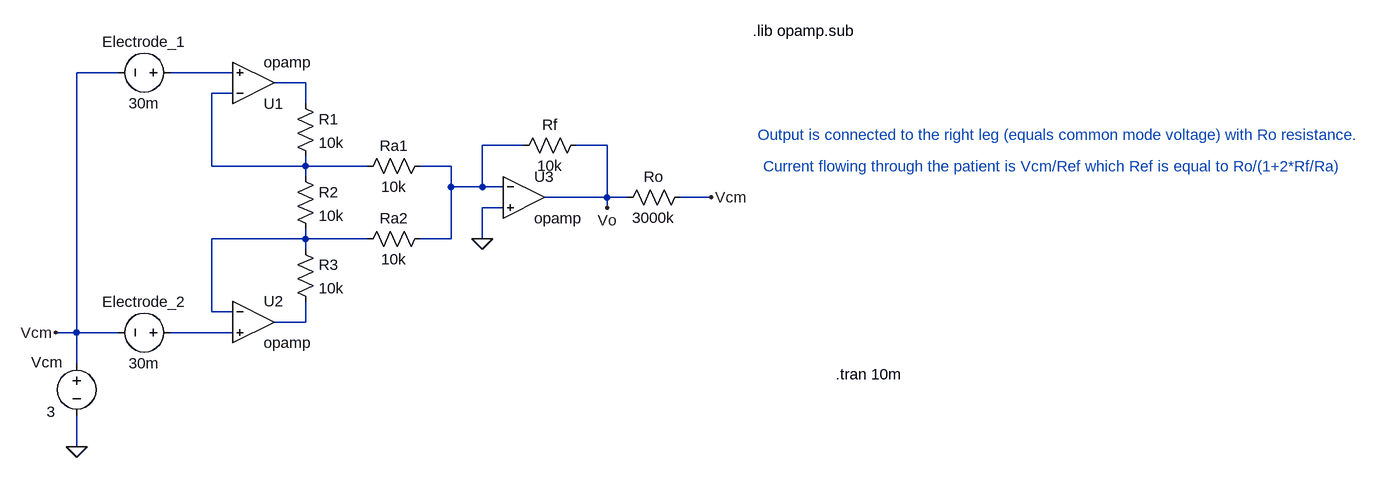
[diagram p0: schematic RightLegDriver.asc]
RightLegDriver.asc, the LTspice schematic file:
Version 4
SHEET 1 1248 932
WIRE -752 -64 -816 -64
WIRE -576 -64 -672 -64
WIRE -464 -48 -512 -48
WIRE -576 -32 -608 -32
WIRE -464 -16 -464 -48
WIRE -128 48 -192 48
WIRE 0 48 -48 48
WIRE -608 80 -608 -32
WIRE -464 80 -464 64
WIRE -464 80 -608 80
WIRE -368 80 -464 80
WIRE -240 80 -288 80
WIRE -464 96 -464 80
WIRE -240 112 -240 80
WIRE -192 112 -192 48
WIRE -192 112 -240 112
WIRE -160 112 -192 112
WIRE 0 128 0 48
WIRE 0 128 -96 128
WIRE 32 128 0 128
WIRE 160 128 112 128
WIRE -160 144 -192 144
WIRE 0 144 0 128
WIRE -464 192 -464 176
WIRE -464 192 -608 192
WIRE -368 192 -464 192
WIRE -240 192 -240 112
WIRE -240 192 -288 192
WIRE -192 192 -192 144
WIRE -464 208 -464 192
WIRE -608 304 -608 192
WIRE -576 304 -608 304
WIRE -464 320 -464 288
WIRE -464 320 -512 320
WIRE -816 336 -816 -64
WIRE -816 336 -848 336
WIRE -752 336 -816 336
WIRE -576 336 -672 336
WIRE -816 384 -816 336
WIRE -816 512 -816 464
FLAG -192 192 0
FLAG 0 144 Vo
FLAG -816 512 0
FLAG -848 336 Vcm
FLAG 160 128 Vcm
SYMBOL OpAmps\\opamp -544 16 M180
SYMATTR InstName U1
SYMBOL OpAmps\\opamp -544 256 R0
SYMATTR InstName U2
SYMBOL res -480 -32 R0
SYMATTR InstName R1
SYMATTR Value 10k
SYMBOL res -480 80 R0
SYMATTR InstName R2
SYMATTR Value 10k
SYMBOL res -480 192 R0
SYMATTR InstName R3
SYMATTR Value 10k
SYMBOL voltage -656 -64 R90
WINDOW 0 -32 56 VBottom 2
WINDOW 3 32 56 VTop 2
WINDOW 123 0 0 Left 0
WINDOW 39 0 0 Left 0
SYMATTR InstName Electrode_1
SYMATTR Value 30m
SYMBOL voltage -656 336 R90
WINDOW 0 -32 56 VBottom 2
WINDOW 3 32 56 VTop 2
SYMATTR InstName Electrode_2
SYMATTR Value 30m
SYMBOL OpAmps\\opamp -128 64 R0
SYMATTR InstName U3
SYMBOL res -272 64 R90
WINDOW 0 0 56 VBottom 2
WINDOW 3 32 56 VTop 2
SYMATTR InstName Ra1
SYMATTR Value 10k
SYMBOL res -272 176 R90
WINDOW 0 0 56 VBottom 2
WINDOW 3 32 56 VTop 2
SYMATTR InstName Ra2
SYMATTR Value 10k
SYMBOL res -32 32 R90
WINDOW 0 0 56 VBottom 2
WINDOW 3 32 56 VTop 2
SYMATTR InstName Rf
SYMATTR Value 10k
SYMBOL res 128 112 R90
WINDOW 0 0 56 VBottom 2
WINDOW 3 32 56 VTop 2
SYMATTR InstName Ro
SYMATTR Value 3000k
SYMBOL voltage -816 368 R0
WINDOW 0 -70 14 Left 2
WINDOW 3 -46 90 Left 2
WINDOW 123 0 0 Left 0
WINDOW 39 0 0 Left 0
SYMATTR InstName Vcm
SYMATTR Value 3
TEXT 352 400 Left 2 !.tran 10m
TEXT 224 -128 Left 2 !.lib opamp.sub
TEXT 232 32 Left 2 ;Output is connected to the right leg (equals common mode voltage) with Ro resistance.
TEXT 240 80 Left 2 ;Current flowing through the patient is Vcm/Ref which Ref is equal to Ro/(1+2*Rf/Ra)

The netlist it stands for:
* RightLegDriver.asc
XU1 N003 N001 N002 opamp Aol=100K GBW=10Meg  ; pins invin noninvin out
XU2 N005 N007 N006 opamp Aol=100K GBW=10Meg  ; pins invin noninvin out
R1 N002 N003 10k
R2 N003 N005 10k
R3 N005 N006 10k
V§Electrode_1 N001 Vcm 30m
V§Electrode_2 N007 Vcm 30m
XU3 N004 0 Vo opamp Aol=100K GBW=10Meg  ; pins invin noninvin out
Ra1 N004 N003 10k
Ra2 N004 N005 10k
Rf Vo N004 10k
Ro Vcm Vo 3000k
Vcm Vcm 0 3
.tran 10m
.lib opamp.sub
* Output is connected to the right leg (equals common mode voltage) with Ro resistance.
* Current flowing through the patient is Vcm/Ref which Ref is equal to Ro/(1+2*Rf/Ra)
.backanno
.end